# Altium schematic sheet RT1064_Device.SchDoc
size A4; SheetNumber: 2; SheetTotal: 4
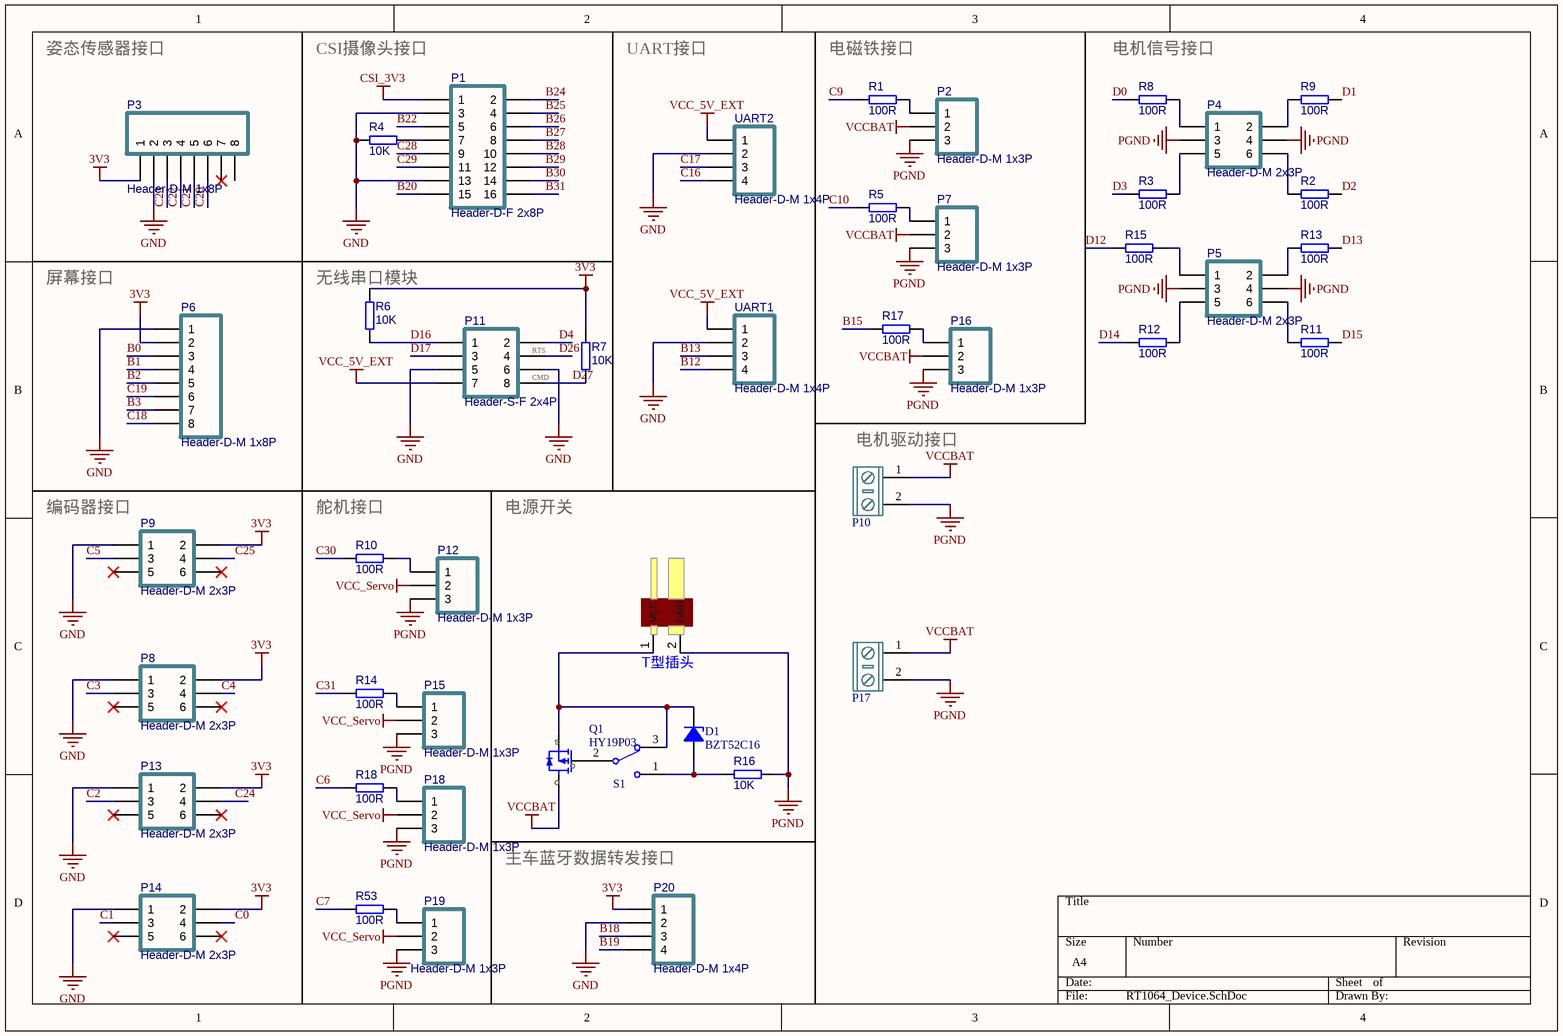
[diagram p0: RT1064_Device.SchDoc]

## Parts
D1  BZT52C16  [SOD-123-L]
DCIN1  T型插头  [CONN-TH_AM-1015B-F]
P1  Header-D-F 2x8P  [Cam_HDR2X8-F-SMT]
P2  Header-D-M 1x3P  [HDR1X3-M]
P3  Header-D-M 1x8P  [Fe-HDR1X8/2.54-S]
P4  Header-D-M 2x3P  [HDR2.54-M-LS-2x3P]
P5  Header-D-M 2x3P  [HDR2.54-M-LS-2x3P]
P6  Header-D-M 1x8P  [Fe-HDR1X8/2.54-S]
P7  Header-D-M 1x3P  [HDR1X3-M]
P8  Header-D-M 2x3P  [DC3-6P-2.54mm]
P9  Header-D-M 2x3P  [DC3-6P-2.54mm]
P10  KF/WJ/DG 30x connecter  [KF/WJ/DG 301-2p-5.0mm]  (value not drawn)
P11  Header-S-F 2x4P  [HDR2X4-F-SMT]
P12  Header-D-M 1x3P  [Fe-HDR1X3/2.54-S]
P13  Header-D-M 2x3P  [DC3-6P-2.54mm]
P14  Header-D-M 2x3P  [DC3-6P-2.54mm]
P15  Header-D-M 1x3P  [Fe-HDR1X3/2.54-S]
P16  Header-D-M 1x3P  [HDR1X3-M]
P17  KF/WJ/DG 30x connecter  [KF/WJ/DG 301-2p-5.0mm]  (value not drawn)
P18  Header-D-M 1x3P  [Fe-HDR1X3/2.54-S]
P19  Header-D-M 1x3P  [Fe-HDR1X3/2.54-S]
P20  Header-D-M 1x4P  [HDR1X4-M]
Q1  HY19P03  [TO-252AA]
R1  value 100R  [RESC1608[0603]S-L]  (hidden comment: 100R ±1%)
R2  value 100R  [RESC1608[0603]S-L]  (hidden comment: 100R ±1%)
R3  value 100R  [RESC1608[0603]S-L]  (hidden comment: 100R ±1%)
R4  value 10K  [RESC1608[0603]S-L]  (hidden comment: 10K ±1%)
R5  value 100R  [RESC1608[0603]S-L]  (hidden comment: 100R ±1%)
R6  value 10K  [RESC1608[0603]S-L]  (hidden comment: 10K ±1%)
R7  value 10K  [RESC1608[0603]S-L]  (hidden comment: 10K ±1%)
R8  value 100R  [RESC1608[0603]S-L]  (hidden comment: 100R ±1%)
R9  value 100R  [RESC1608[0603]S-L]  (hidden comment: 100R ±1%)
R10  value 100R  [RESC1608[0603]S-L]  (hidden comment: 100R ±1%)
R11  value 100R  [RESC1608[0603]S-L]  (hidden comment: 100R ±1%)
R12  value 100R  [RESC1608[0603]S-L]  (hidden comment: 100R ±1%)
R13  value 100R  [RESC1608[0603]S-L]  (hidden comment: 100R ±1%)
R14  value 100R  [RESC1608[0603]S-L]  (hidden comment: 100R ±1%)
R15  value 100R  [RESC1608[0603]S-L]  (hidden comment: 100R ±1%)
R16  value 10K  [RESC1608[0603]S-L]  (hidden comment: 10K ±1%)
R17  value 100R  [RESC1608[0603]S-L]  (hidden comment: 100R ±1%)
R18  value 100R  [RESC1608[0603]S-L]  (hidden comment: 100R ±1%)
R53  value 100R  [RESC1608[0603]S-L]  (hidden comment: 100R ±1%)
S1  SW-SPDT  [SS-12F23]  (value not drawn)
UART1  Header-D-M 1x4P  [XH2.54-WI-4P]
UART2  Header-D-M 1x4P  [XH2.54-WI-4P]

## Nets
3V3: P3.1 P6.2 P8.2 P9.2 P13.2 P14.2 P20.1 R6.2 R7.2
CSI_3V3: P1.1
GND: P1.3 P1.13 P3.2 P6.1 P8.1 P9.1 P11.5 P11.6 P13.1 P14.1 P20.2 R4.2 UART1.2 UART2.2
PGND: DCIN1.2(GND) P2.3 P4.3 P4.4 P5.3 P5.4 P7.3 P10.2 P12.3 P15.3 P16.3 P17.2 P18.3 P19.3 R16.1
VCC_5V_EXT: P11.7 UART1.1 UART2.1
VCC_Servo: P12.2 P15.2 P18.2 P19.2
VCCBAT: P2.2 P7.2 P10.1 P16.2 P17.1 Q1.1(D)
B0: P6.3
B1: P6.4
B2: P6.5
B3: P6.7
B12: UART1.4
B13: UART1.3
B15: R17.2
B18: P20.3
B19: P20.4
B20: P1.15
B22: P1.5
B24: P1.2
B25: P1.4
B26: P1.6
B27: P1.8
B28: P1.10
B29: P1.12
B30: P1.14
B31: P1.16
C0: P14.4
C1: P14.3
C2: P13.3
C3: P8.3
C4: P8.4
C5: P9.3
C6: R18.2
C7: R53.2
C9: R1.2
C10: R5.2
C16: UART2.4
C17: UART2.3
C18: P6.8
C19: P6.6
C20: P3.6
C21: P3.5
C22: P3.4
C23: P3.3
C24: P13.4
C25: P9.4
C28: P1.9
C29: P1.11
C30: R10.2
C31: R14.2
D0: R8.1
D1: R9.1
D2: R2.1
D3: R3.1
D4: P11.2
D12: R15.1
D13: R13.1
D14: R12.1
D15: R11.1
D16: P11.1 R6.1
D17: P11.3
D26: P11.4
D27: P11.8 R7.1
NetD1_A: D1.A R16.2 S1.1
NetD1_K: D1.K DCIN1.1(VCC) Q1.3(S) S1.3
NetP1_7: P1.7 R4.1
NetP2_1: P2.1 R1.1
NetP4_1: P4.1 R8.2
NetP4_2: P4.2 R9.2
NetP4_5: P4.5 R3.2
NetP4_6: P4.6 R2.2
NetP5_1: P5.1 R15.2
NetP5_2: P5.2 R13.2
NetP5_5: P5.5 R12.2
NetP5_6: P5.6 R11.2
NetP7_1: P7.1 R5.1
NetP12_1: P12.1 R10.1
NetP15_1: P15.1 R14.1
NetP16_1: P16.1 R17.1
NetP18_1: P18.1 R18.1
NetP19_1: P19.1 R53.1
NetQ1_2: Q1.2(G) S1.2

Not connected (* = marked no-connect by the designer): P3 7* 8; P8 5* 6*; P9 5* 6*; P13 5* 6*; P14 5* 6*

## Notes on the sheet
- 姿态传感器接口
- CSI摄像头接口
- UART接口
- (near R1) 电磁铁接口
- (near R8) 电机信号接口
- 屏幕接口
- (near R6) 无线串口模块
- (near P11) RTS
- (near P11) CMD
- (near P10) 电机驱动接口
- 编码器接口
- (near R10) 舵机接口
- 电源开关
- 主车蓝牙数据转发接口

## Library data of the parts
D1 = Diode Zen: 稳压二极管 齐纳二极管  Zener Diode; Published: 8-Jun-2000; Revision: July-2002: Re-released for DXP Platform.; Publisher: Altium Limited; Price(RMB): 0.000
DCIN1 = T_Header
P1 = Header-D-F 2x8P: 2x8pin, 直插, 双排座; Revision: V1.0; Value: Header-D-F 2x8P
P2 P7 P12 P15 P16 P18 P19 = Header-D-M 1x3P: 1x3pin, 直插, 排针; Revision: V1.0; Value: Header-D-M 1x3P
P3 P6 = Header-D-M 1x8P: 1x8pin, 直插, 排针; Revision: V1.0; Value: Header-D-M 1x8P
P4 P5 P8 P9 P13 P14 = Header-S-M 2x3P: 2x3pin, 贴片, 双排针; Revision: V1.0; Value: Header-D-M 2x3P
P10 P17 = KF/WJ/DG 30x: 接线端子 2Pin
P11 = Header-S-F 2x4P: 2x4pin, 贴片, 双排座; Revision: V1.0; Value: Header-S-F 2x4P
P20 UART1 UART2 = Header-D-M 1x4P: 1x4pin, 直插, 排针; Revision: V1.0; Value: Header-D-M 1x4P
Q1 = HY19P03: HY19P03 P-Channel MOSFET
R1-R18 R53 = Res-Chip: 贴片电阻; Power: 1/8W; Revision: V1.0; Tolerance: ±1%
S1 = SW-SPDT: 单刀双掷开关 3脚船型、钮子、拨动开关 SPDT Subminiature Toggle Switch; Published: 24-Mar-1999; Publisher: Altium Limited; Price(RMB): 0.000